# Altium schematic sheet Power.SchDoc
size Letter; SheetNumber: 8; PageSetup: Record=PageOptions|CenterHorizontal=True|CenterVertical=True|PrintScale=0.98|XCorrection=1.00|YCorrection=1.00|PrintKind=0|BorderSize=5000000|LeftOffset=0|BottomOffset=0|Orientation=2|PaperLength=1000|PaperWidth=1000|Scale=100|PaperSource=7|PrintQuality=-3|MediaType=1|DitherType=10|PrintScaleMode=1|PaperKind=Letter|PaperIndex=1
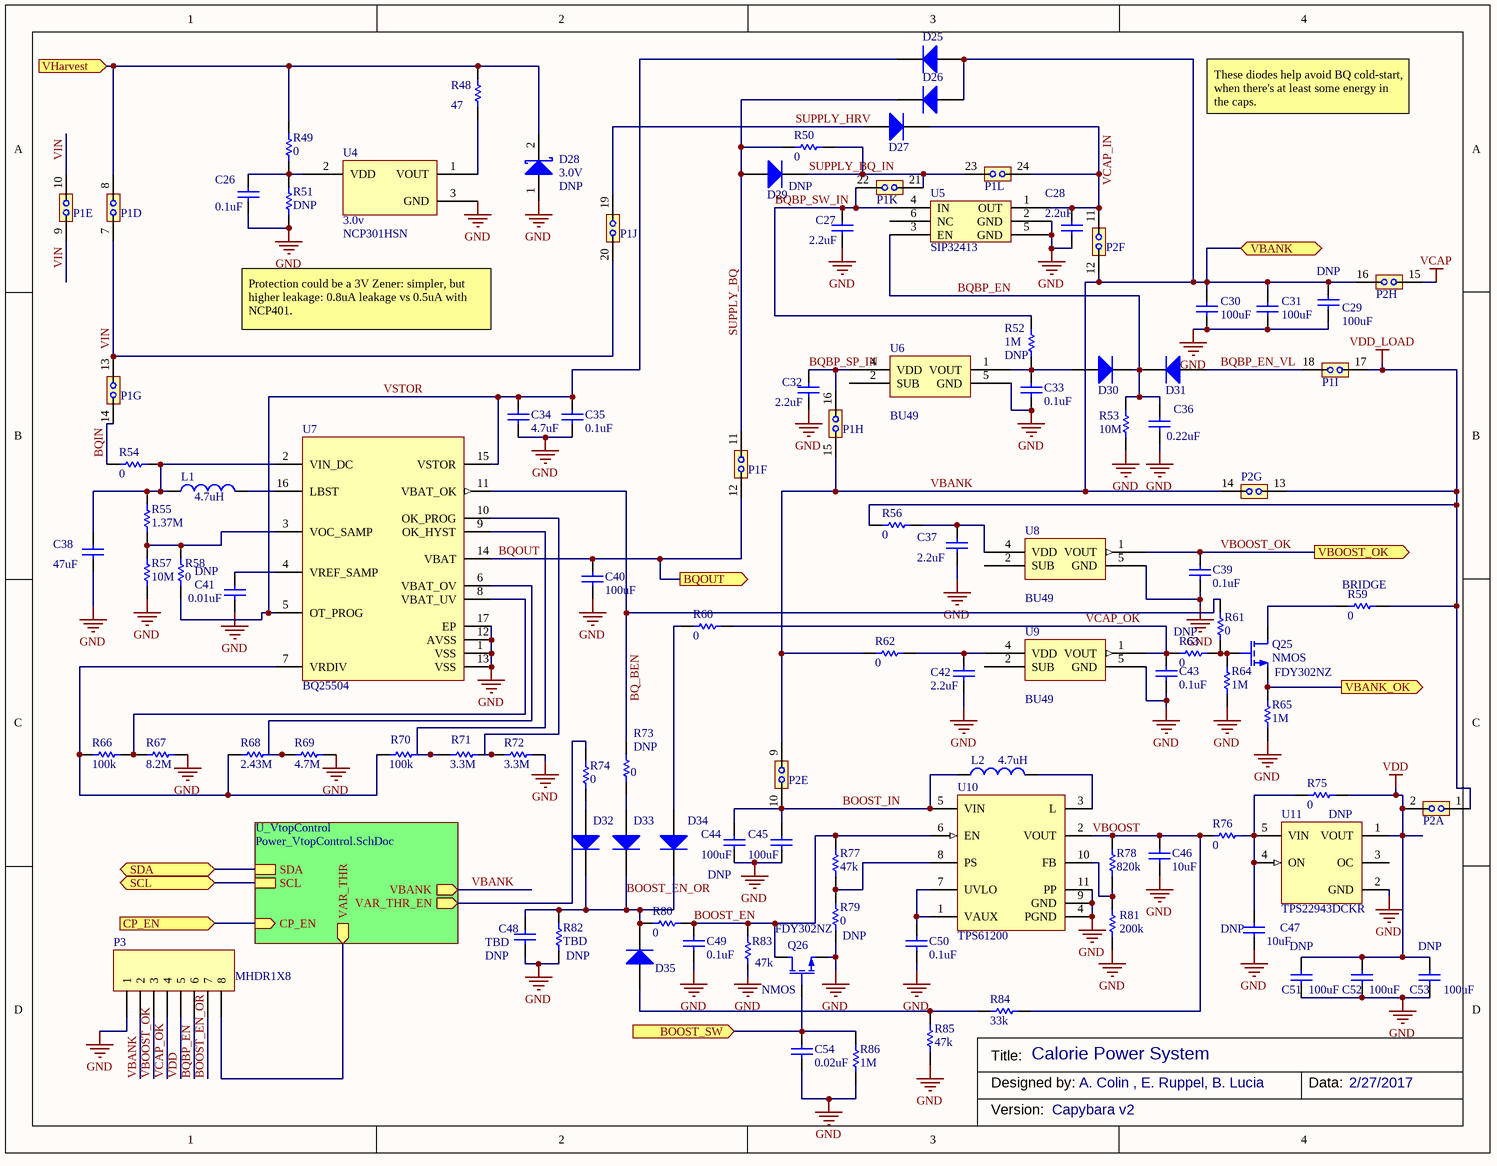
[diagram p0: Power.SchDoc]

## Parts
C26  value 0.1uF  [0603]  (hidden comment: Cap)
C27  value 2.2uF  [0603]  (hidden comment: Cap)
C28  value 2.2uF  [0603]  (hidden comment: Cap)
C29  value 100uF  Note: DNP  [0805]  (hidden comment: Cap)
C30  value 100uF  [0805]  (hidden comment: Cap)
C31  value 100uF  [0805]  (hidden comment: Cap)
C32  value 2.2uF  [0603]  (hidden comment: Cap)
C33  value 0.1uF  [0603]  (hidden comment: Cap)
C34  value 4.7uF  [0603]  (hidden comment: Cap)
C35  value 0.1uF  [0603]  (hidden comment: Cap)
C36  value 0.22uF  [0603]  (hidden comment: Cap)
C37  value 2.2uF  [0603]  (hidden comment: Cap)
C38  value 47uF  [0603]  (hidden comment: Cap)
C39  value 0.1uF  [0603]  (hidden comment: Cap)
C40  value 100uF  [0805]  (hidden comment: Cap)
C41  value 0.01uF  [0603]  (hidden comment: Cap)
C42  value 2.2uF  [0603]  (hidden comment: Cap)
C43  value 0.1uF  [0603]  (hidden comment: Cap)
C44  value 100uF  Note: DNP  [0805]  (hidden comment: Cap)
C45  value 100uF  [0805]  (hidden comment: Cap)
C46  value 10uF  [0603]  (hidden comment: Cap)
C47  value 10uF  Note: DNP  [0805]  (hidden comment: Cap)
C48  value TBD  Note: DNP  [0603]  (hidden comment: Cap)
C49  value 0.1uF  [0603]  (hidden comment: Cap)
C50  value 0.1uF  [0603]  (hidden comment: Cap)
C51  value 100uF  Note: DNP  [0805]  (hidden comment: Cap)
C52  value 100uF  [0805]  (hidden comment: Cap)
C53  value 100uF  Note: DNP  [0805]  (hidden comment: Cap)
C54  value 0.02uF  [0603]  (hidden comment: Cap)
D25  Diode  [SOD-523]  (value not drawn)
D26  Diode  [SOD-523]  (value not drawn)
D27  Diode  [SOD-523]  (value not drawn)
D28  3.0V  Note: DNP  [DIOD-SOD-123-2_V]
D29  Note: DNP  [SOD-523]  (hidden comment: Diode)
D30  Diode  [SOD-523]  (value not drawn)
D31  Diode  [SOD-523]  (value not drawn)
D32  Diode  [SOD-523]  (value not drawn)
D33  Diode  [SOD-523]  (value not drawn)
D34  Diode  [SOD-523]  (value not drawn)
D35  Diode  [SOD-523]  (value not drawn)
L1  value 4.7uH  [PFL1609]
L2  value 4.7uH  [PFL1609]
P1  JMPHDR_12  [MHDR2X12]  (value not drawn)  (parts D,E,F,G,H,I,J,K,L of 12)
P2  JMPHDR_8  (value not drawn)  (parts A,E,F,G,H of 8)
P3  MHDR1X8  [MHDR1X8]
Q25  NMOS  Manufacturer Part Number: FDY302NZ  [SOT-523-3]
Q26  NMOS  Manufacturer Part Number: FDY302NZ  [SOT-523-3]
R48  value 47  [0603]  (hidden comment: Res)
R49  value 0  [0603]  (hidden comment: Res)
R50  value 0  [0603]  (hidden comment: Res)
R51  value DNP  [0603]  (hidden comment: Res)
R52  value 1M  Note: DNP  [0603]  (hidden comment: Res)
R53  value 10M  [0603]  (hidden comment: Res)
R54  value 0  [0603]  (hidden comment: Res)
R55  value 1.37M  [0603]  (hidden comment: Res)
R56  value 0  [0603]  (hidden comment: Res)
R57  value 10M  [0603]  (hidden comment: Res)
R58  value 0  Note: DNP  [0603]  (hidden comment: Resistor)
R59  value 0  Note: BRIDGE  [0603]  (hidden comment: Res)
R60  value 0  [0603]  (hidden comment: Res)
R61  value 0  [0603]  (hidden comment: Res)
R62  value 0  [0603]  (hidden comment: Res)
R63  value 0  Note: DNP  [0603]  (hidden comment: Res)
R64  value 1M  [0603]  (hidden comment: Res)
R65  value 1M  [0603]  (hidden comment: Res)
R66  value 100k  [0603]  (hidden comment: Res)
R67  value 8.2M  [0603]  (hidden comment: Res)
R68  value 2.43M  [0603]  (hidden comment: Res)
R69  value 4.7M  [0603]  (hidden comment: Res)
R70  value 100k  [0603]  (hidden comment: Res)
R71  value 3.3M  [0603]  (hidden comment: Res)
R72  value 3.3M  [0603]  (hidden comment: Res)
R73  value 0  [0603]  (hidden comment: DNP)
R74  value 0  [0603]  (hidden comment: Res)
R75  value 0  [0603]  (hidden comment: Res)
R76  value 0  [0603]  (hidden comment: Res)
R77  value 47k  [0603]  (hidden comment: Res)
R78  value 820k  [0603]  (hidden comment: Res)
R79  value 0  [0603]  (hidden comment: DNP)
R80  value 0  [0603]  (hidden comment: Res)
R81  value 200k  [0603]  (hidden comment: Res)
R82  value TBD  Note: DNP  [0603]  (hidden comment: Res)
R83  value 47k  [0603]  (hidden comment: Res)
R84  value 33k  [0603]  (hidden comment: Res)
R85  value 47k  [0603]  (hidden comment: Res)
R86  value 1M  [0603]  (hidden comment: Res)
U4  value 3.0v  Name: NCP301HSN  [SOT23-5]  (hidden comment: NCP301)
U5  SIP32413  [SC70-6]
U6  Name: BU49  [SOP4]  (hidden comment: BU48)
U7  BQ25504  [VQFN-16]
U8  BU49  [SOP4]
U9  BU49  [SOP4]
U10  TPS61200  [VSON-10]
U11  TPS22943DCKR  Note: DNP  [SC70-5]

## Sub-sheets
U_VtopControl = Power_VtopControl.SchDoc: SDA, SCL, CP_EN (in), VAR_THR_EN (out), VAR_THR (out), VBANK

## Ports
BOOST_SW (in), BQOUT (out), CP_EN (in), SCL, SDA, VBANK, VBANK_OK (out), VBOOST_OK (out), VHarvest (in)

## Nets
GND: C26.1 C27.1 C28.1 C29.1 C30.1 C31.1 C32.1 C33.1 C34.1 C35.1 C36.1 C37.1 C38.2 C39.1 C40.1 C41.1 C42.1 C43.1 C44.1 C45.1 C46.1 C47.1 C48.2 C49.1 C50.1 C51.1 C52.1 C53.1 C54.1 D28.1(A) P3.1 Q26.2(S) R51.1 R53.1 R57.1 R64.1 R65.1 R67.2 R69.2 R72.2 R79.1 R81.1 R82.1 R83.1 R85.1 R86.1 U4.3(GND) U5.2(GND) U5.5(GND) U6.5(GND) U7.1(VSS) U7.12(AVSS) U7.13(VSS) U7.17(EP) U8.5(GND) U9.5(GND) U10.4(PGND) U10.9(GND) U10.11(PP) U11.2(GND)
VCAP: P2.15
VDD: C51.2 C52.2 C53.2 P2.2 P3.5 R75.2 U11.1(VOUT)
VDD_LOAD: P1.17 P2.1 P2.13 R56.2 R59.2
BOOST_EN: C49.2 Q26.3(D) R77.2 R80.2 R83.2 U10.6(EN)
BOOST_EN_OR: C48.1 D32.2(C) D33.2(C) D34.2(C) D35.2(C) P3.7 R80.1 R82.2
BOOST_IN: C44.2 C45.2 L2.1 P2.10 U10.5(VIN)
BOOST_SW: C54.2 Q26.1(G) R86.2 ; port BOOST_SW
BQ_BEN: R61.2 R73.2 U7.11(VBAT_OK)
BQBP_EN: C36.2 D30.2(C) D31.2(C) P3.6 R53.2 U5.3(EN)
BQBP_EN_VL: D31.1(A) P1.18
BQBP_SP_IN: C32.2 P1.16 U6.4(VDD)
BQBP_SW_IN: C27.2 P1.22 R52.2 U5.4(IN)
BQIN: P1.14 R54.1
BQOUT: C40.2 P1.12 U7.14(VBAT) ; port BQOUT
CP_EN: port CP_EN, sheet U_VtopControl/CP_EN
SCL: port SCL, sheet U_VtopControl/SCL
SDA: port SDA, sheet U_VtopControl/SDA
SUPPLY_BQ: D26.2(C) D29.1(A) P1.11 R50.1
SUPPLY_BQ_IN: D29.2(C) P1.21 P1.23 R50.2
SUPPLY_HRV: D27.1(A) P1.19
VBANK: C29.2 C30.2 C31.2 D25.1(A) D26.1(A) P1.15 P2.9 P2.12 P2.14 P2.16 P3.2 R62.1 ; port VBANK, sheet U_VtopControl/VBANK
VBANK_OK: Q25.2(S) R65.2 ; port VBANK_OK
VBOOST: C46.2 R76.1 R78.2 R84.2 U10.2(VOUT)
VBOOST_OK: C39.2 P3.3 U8.1(VOUT) ; port VBOOST_OK
VCAP_IN: C28.2 D27.2(C) P1.24 P2.11 U5.1(OUT)
VCAP_OK: C43.2 P3.4 R60.2 R63.1 U9.1(VOUT)
VHarvest: D28.2(K) P1.8 R48.1 R49.2 ; port VHarvest
VIN: P1.7 P1.9 P1.10 P1.13 P1.20
VSTOR: C34.2 C35.2 D25.2(C) R58.1 U7.5(OT_PROG) U7.15(VSTOR)
NetC26_2: C26.2 R49.1 R51.2 U4.2(VDD)
NetC33_2: C33.2 D30.1(A) R52.1 U6.1(VOUT)
NetC37_2: C37.2 R56.1 U8.4(VDD)
NetC38_1: C38.1 L1.1 R54.2 R55.2 U7.2(VIN_DC)
NetC41_2: C41.2 U7.4(VREF_SAMP)
NetC42_2: C42.2 R62.2 U9.4(VDD)
NetC47_2: C47.2 R75.1 R76.2 U11.4(ON) U11.5(VIN)
NetC50_2: C50.2 U10.1(VAUX) U10.7(UVLO)
NetD32_1: D32.1(A) R74.1
NetD33_1: D33.1(A) R73.1
NetD34_1: D34.1(A) R60.1
NetD35_1: D35.1(A) R84.1 R85.2
NetL1_2: L1.2 U7.16(LBST)
NetL2_2: L2.2 U10.3(L)
NetP3_8: P3.8 ; sheet U_VtopControl/VAR_THR
NetQ25_1: Q25.1(G) R61.1 R63.2 R64.2
NetQ25_3: Q25.3(D) R59.1
NetR48_2: R48.2 U4.1(VOUT)
NetR55_1: R55.1 R57.2 R58.2 U7.3(VOC_SAMP)
NetR66_1: R66.1 R68.1 R70.1 U7.7(VRDIV)
NetR66_2: R66.2 R67.1 U7.8(VBAT_UV)
NetR68_2: R68.2 R69.1 U7.6(VBAT_OV)
NetR70_2: R70.2 R71.1 U7.9(OK_HYST)
NetR71_2: R71.2 R72.1 U7.10(OK_PROG)
NetR74_2: R74.2 ; sheet U_VtopControl/VAR_THR_EN
NetR77_1: R77.1 R79.2 U10.8(PS)
NetR78_1: R78.1 R81.2 U10.10(FB)

Not connected (* = marked no-connect by the designer): U5 6(NC); U6 2(SUB); U8 2(SUB); U9 2(SUB); U11 3(OC)

## Notes on the sheet
- These diodes help avoid BQ cold-start, when there's at least some energy in the caps.
- Protection could be a 3V Zener: simpler, but higher leakage: 0.8uA leakage vs 0.5uA with NCP401.
- Title:
- Designed by:
- (near R84) Calorie Power System
- A. Colin , E. Ruppel, B. Lucia
- Data:
- 2/27/2017
- Version:
- Capybara v2

## Library data of the parts
C26 C33 C35 C39 C43 C49 C50 = Cap: Ceramic Capacitor (Surface Mount); Manufacturer: Murata Electronics North America; Manufacturer Part Number: GRM188R71C104KA01D; Note: *; Rating: *; Distributor Part Number: 490-1532-1-ND; Distributor: Digi-Key
  C26 C33 C35 C39 C43: Digi-Key Part Number: *
C27 C28 C32 C37 C42 = Cap: Ceramic Capacitor (Surface Mount); Manufacturer: Murata Electronics North America; Manufacturer Part Number: GRM188R61C225KE15D; Note: *; Rating: *; Distributor Part Number: 490-3296-1-ND; Distributor: Digi-Key
C29 = Cap: Ceramic Capacitor (Surface Mount); Manufacturer: Murata Electronics North America; Manufacturer Part Number: GRM21BR60J107ME15L; Rating: 6.3V; PurchaseNote: 47uF 587-3266-1-ND; Distributor Part Number: 490-13981-1-ND; Distributor: Digi-Key
C30 C31 = Cap: Ceramic Capacitor (Surface Mount); Manufacturer: Murata Electronics North America; Manufacturer Part Number: GRM21BR60G107ME15L; Rating: 6.3V; PurchaseNote: 47uF 587-3266-1-ND; Distributor: Mouser; Mouser Part Number: 81-GRM21BR60G107ME5L
C34 = Cap: Ceramic Capacitor (Surface Mount); Manufacturer: Samsung Electro-Mechanics; Manufacturer Part Number: CL10B475KQ8NQNC; Digi-Key Part Number: *; Note: *; Rating: *; Distributor Part Number: 1276-2087-1-ND; Distributor: Digi-Key
C36 = Cap: Ceramic Capacitor (Surface Mount); Manufacturer: Murata Electronics North America; Manufacturer Part Number: GRM188R71E224KA88D; Note: *; Rating: *; Distributor Part Number: 490-3290-1-ND; Distributor: Digi-Key
C38 = Cap: Ceramic Capacitor (Surface Mount); Manufacturer: Samsung Electro-Mechanics; Manufacturer Part Number: CL10A476MR8NZNE; Note: *; Distributor Part Number: 1276-6528-1-ND; Distributor: Digi-Key
C40 = Cap: Ceramic Capacitor (Surface Mount); Manufacturer: Murata Electronics North America; Manufacturer Part Number: GRM21BR60G107ME15L; Rating: 6.3V; Digi-Key Part Number: *; Note: *; Distributor: Mouser; Mouser Part Number: 81-GRM21BR60G107ME5L
C41 = Cap: Ceramic Capacitor (Surface Mount); Manufacturer: Murata Electronics North America; Manufacturer Part Number: GRM155R71E103JA01J; Rating: X7R, 10%; Note: *; Distributor Part Number: 490-6340-1-ND; Distributor: Digi-Key
C44 C45 = Cap: Ceramic Capacitor (Surface Mount); Manufacturer: Murata Electronics North America; Manufacturer Part Number: GRM21BR60G107ME15L; PurchaseNote: or CL10A476MR8NZNE 4.0V 0.8mm; Rating: *; Distributor: Mouser; Mouser Part Number: 81-GRM21BR60G107ME5L
  C45: Note: *
C46 = Cap: Ceramic Capacitor (Surface Mount); Manufacturer: Murata Electronics North America; Manufacturer Part Number: GRM188R60J106ME47D; Note: *; Rating: *; Distributor Part Number: 490-3896-1-ND; Distributor: Digi-Key
C47 = Cap: Ceramic Capacitor (Surface Mount); Manufacturer: Murata Electronics North America; Manufacturer Part Number: GRM21BR61E106MA73L; Rating: *; Distributor Part Number: 490-10748-1-ND; Distributor: Digi-Key
C48 = Cap: Ceramic Capacitor (Surface Mount); Manufacturer: Generic Ceramic Chip Cap (TBD); Digi-Key Part Number: *; Manufacturer Part Number: *; Rating: *; Distributor Part Number: *; Distributor: *
C51-C53 = Cap: Ceramic Capacitor (Surface Mount); Manufacturer: Murata Electronics North America; Manufacturer Part Number: GRM21BR60G107ME15L; Rating: *; Distributor: Mouser; Mouser Part Number: 81-GRM21BR60G107ME5L
  C52: Note: *
C54 = Cap: Ceramic Capacitor (Surface Mount); Manufacturer: Samsung Electro-Mechanics; Manufacturer Part Number: CL10B203KB8NNNC; Digi-Key Part Number: *; Note: *; Rating: *; Distributor Part Number: 1276-1984-1-ND; Distributor: Digi-Key
D25-D27 D29-D35 = Diode: General Purpose Diode; Manufacturer: Vishay Semiconductor; Manufacturer Part Number: BAS40-02V-V-G-08; Digi-Key Part Number: BAS40-02V-V-G-08GICT-ND; Value: *; Rating: *; Distributor Part Number: 78-BAS40-02V-V-G-08; Distributor: Mouser; Mouser Part Number: 78-BAS40-02V-V-G-08
  D27 D30-D35: Note: *
D28 = CMP-0303-00003-1: 1.0 A Surface Mount Schottky Barrier Rectifier, 40 V, -65 to 125 degC, 2-Pin SOD-123 Package, RoHS, Tape and Reel; Manufacturer Part Number: MMSZ4683-TP; Manufacturer: Micro Commercial Co; PackageDescription: 2-Pin SOD-123, Body 2.7 x 1.55 mm, Pitch 3.7 mm; PackageReference: SOD-123-2; Digi-Key Part Number: MMSZ4683-TPMSCT-ND
L1 L2 = Inductor: Manufacturer: Coilcraft; Manufacturer Part Number: PFL1609-472MEU; PackageReference: PFL1609; Distributor: Mouser; Distributor Part Number: 994-PFL1609-472MEU
P2 = JMPHDR_8: Manufacturer: Sullins Connector Solutions; Manufacturer Part Number: GRPB082VWVN-RC; Digi-Key Part Number: S9015E-08-ND; Distributor: Digikey; Distributor Part Number: S9015E-08-ND
P3 = MHDR1X8: Header, 8-Pin; Manufacturer: Harwin Inc.; Manufacturer Part Number: M52-5000845; LatestRevisionDate: 17-Jul-2002; LatestRevisionNote: Re-released for DXP Platform.; Publisher: Altium Limited; Digi-Key Part Number: 952-3361-ND; Distributor: Mouser; Distributor Part Number: 855-M52-5000845; Mouser Part Number: 855-M52-5000845
Q25 Q26 = MOSFET-N: N-Channel MOSFET; Manufacturer: Fairchild; Note: *; Rating: *; Value: NMOS; Distributor: Digi-Key; Distributor Part Number: FDY302NZCT-ND
  Q26: Digi-Key Part Number: *
R48 = Res: Chip Resistor (Surface Mount); Manufacturer: Yageo; Manufacturer Part Number: RC0603JR-0747RL; Digi-Key Part Number: *; Rating: *; Note: *; Distributor: Digi-Key; Distributor Part Number: 311-47GRCT-ND
R49 R50 R54 R56 R58-R63 R73-R76 R79 R80 = Res: Chip Resistor (Surface Mount); Manufacturer: Yageo; Manufacturer Part Number: RC0603JR-070RL; Rating: *; Distributor: Digi-Key; Distributor Part Number: 311-0.0GRCT-ND
  R49 R54 R56 R60-R62 R80: Note: *
  R73: Digi-Key Part Number: *; Note: DNP
  R74 R76: Digi-Key Part Number: *; Note: *
  R75: Digi-Key Part Number: *
  R79: Note: DNP
R51 = Res: Chip Resistor (Surface Mount); Manufacturer: Yageo; Digi-Key Part Number: *; Rating: *; Note: *; Distributor: Digi-Key
R52 R64 R65 = Res: Chip Resistor (Surface Mount); Manufacturer: Yageo; Manufacturer Part Number: RC0603FR-071ML; Rating: *; Distributor: Digi-Key; Distributor Part Number: 311-1.00MHRCT-ND
  R52: Digi-Key Part Number: *
  R64 R65: Note: *
R53 R57 R86 = Res: Chip Resistor (Surface Mount); Manufacturer: Yageo; Manufacturer Part Number: RC0603JR-0710ML; Rating: *; Distributor: Digi-Key; Distributor Part Number: 311-10MGRCT-ND
  R57: Note: *
  R86: Digi-Key Part Number: *; Note: *
R55 = Res: Chip Resistor (Surface Mount); Manufacturer: Vishay Dale; Manufacturer Part Number: CRCW04021M37FKED; Rating: *; Note: *; Distributor: Digi-Key; Distributor Part Number: 541-1.37MLCT-ND
R66 = Res: Chip Resistor (Surface Mount); Manufacturer: Yageo; Manufacturer Part Number: RT0603FRE07100KL; Rating: 1%; Note: *; Distributor: Digi-Key; Distributor Part Number: YAG2319CT-ND
R67 = Res: Chip Resistor (Surface Mount); Manufacturer: Vishay Dale; Manufacturer Part Number: CRCW06038M20FKEA; Rating: 1%; Note: *; Distributor: Digi-Key; Distributor Part Number: 541-8.20MHCT-ND
R68 = Res: Chip Resistor (Surface Mount); Manufacturer: Vishay; Manufacturer Part Number: CRCW06032M43FKEA; Note: *; Distributor: Mouser; Distributor Part Number: 71-CRCW0603-2.43M-E3; Mouser Part Number: 71-CRCW0603-2.43M-E3
R69 = Res: Chip Resistor (Surface Mount); Manufacturer: Generic Chip Res (TBD); Manufacturer Part Number: RC0603FR-074M7L; Rating: 1%; Note: *; Distributor: Digi-Key; Distributor Part Number: 311-4.70MHRCT-ND
R70 R71 = Res: Chip Resistor (Surface Mount); Manufacturer: Yageo; Manufacturer Part Number: RC0603FR-071M6L; Rating: 1%; Distributor: Digi-Key; Distributor Part Number: YAG3327CT-ND
R72 = Res: Chip Resistor (Surface Mount); Manufacturer: Vishay Dale; Manufacturer Part Number: CRCW06033M30FKEA; Rating: 1%; Distributor: Digi-Key; Distributor Part Number: 541-3.30MHCT-ND
R77 R83 R85 = Res: Chip Resistor (Surface Mount); Manufacturer: Yageo; Manufacturer Part Number: RT0603DRD0747KL; Rating: *; Note: *; Distributor: Digi-Key; Distributor Part Number: 311-47KDCT-ND
  R85: Digi-Key Part Number: *
R78 = Res: Chip Resistor (Surface Mount); Manufacturer: Yageo; Manufacturer Part Number: RC0603FR-07820KL; Rating: *; Distributor: Digi-Key; Distributor Part Number: 311-820KHRCT-ND
R81 = Res: Chip Resistor (Surface Mount); Manufacturer: Yageo; Manufacturer Part Number: RC0603FR-07200KL; Rating: *; Note: *; Distributor: Digi-Key; Distributor Part Number: 311-200KHRCT-ND
R82 = Res: Chip Resistor (Surface Mount); Manufacturer: Generic Chip Res (TBD); Manufacturer Part Number: *; Digi-Key Part Number: *; Rating: *
R84 = Res: Chip Resistor (Surface Mount); Manufacturer: Yageo; Manufacturer Part Number: RT0603DRE0733KL; Digi-Key Part Number: *; Rating: *; Note: *; Distributor: Digi-Key; Distributor Part Number: 311-2543-1-ND
U4 = NCP301: IC DETECTOR OPEN-DRAIN; Manufacturer: ON Semiconductor; Manufacturer Part Number: NCP301HSN30T1G; Digi-Key Part Number: NCP301HSN30T1GOSCT-ND; Distributor: Mouser; Distributor Part Number: 863-NCP301HSN30T1G; Mouser Part Number: 863-NCP301HSN30T1G
U5 = SIP32431: Manufacturer: Vishay Semiconductors; Manufacturer Part Number: SIP32431DR3-T1GE3; Digi-Key Part Number: SIP32431DR3-T1GE3CT-ND; Distributor: Mouser; Distributor Part Number: 781-SIP32431DR3-GE3; Mouser Part Number: 781-SIP32431DR3-GE3
U6 = BU48: IC DETECTOR OPEN-DRAIN; pin to pad: 2>3 4>2 5>4; Manufacturer: ROHM Semiconductor; Manufacturer Part Number: BU4917F-TR; Digi-Key Part Number: BU4917F-TR-ND; Distributor: Quest Components; Distributor Part Number: BU4917F-TR; Mouser Part Number: 755-BU4917F-TR
U7 = BQ25504: Manufacturer: BQ25504RGTT; Manufacturer Part Number: Texas Instruments; Digi-Key Part Number: 296-29741-1-ND; Distributor: Mouser; Distributor Part Number: 595-BQ25504RGTR; Mouser Part Number: 595-BQ25504RGTR
U8 U9 = BU49: IC DETECTOR CMOS; pin to pad: 2>3 4>2 5>4; Manufacturer: ROHM Semiconductor; Manufacturer Part Number: BU4924F-TR; Name: BU49; Digi-Key Part Number: BU4924F-TR-ND; Distributor: Quest Components; Distributor Part Number: BU4924F-TR; Mouser Part Number: 755-BU4924F-TR
U10 = TPS61200: Manufacturer: Texas Instruments; Manufacturer Part Number: TPS61200DRCR; Distributor: Digi-Key; Distributor Part Number: 296-27017-1-ND; Digi-Key Part Number: 296-27017-1-ND; Mouser Part Number: 595-TPS61200DRCR
U11 = CMP-0329-00079-2: Low-Input Voltage 40 mA Current Limited Load Switch, 400 mOhms rDS(On), -40 to 85 degC, 5-pin SC70 (DCK), Green (RoHS & no Sb/Br); Manufacturer: Texas Instruments; SubFamily: Current Limited Switch; Vin(Min)(V): 1.62; Number of FETs: 1; Adjustable Current Limit(Min)(A): 0.04; Enable/Shutdown: Active High; Vin(Max)(V): 5.5; rDS(on) per FET(Typ)(mOhms): 400; Iq(Typ)(uA): 40; PackageReference: DCK0005A; PackageDescription: 5-Pin Plastic Small-Outline Package, 2 x 1.3 mm Body, 0.65 mm Pitch, 2.1 mm Lead Span; DatasheetVersion: SLVS832C; ComponentLink1URL: http://www.ti.com/general/docs/lit/getliterature.tsp?genericPartNumber=TPS22943&fileType=pdf; Mounting Technology: Surface Mount; Code_JEDEC: MO-203-AA; PartNumber: TPS22943DCKR; PackageVersion: revG, Jan-2007; Eco-Plan: Green (RoHS & no Sb/Br); ComponentLink1Description: Datasheet; Distributor: Digi-Key; Distributor Part Number: 296-25316-1-ND; Manufacturer Part Number: TPS22943DCKR; Digi-Key Part Number: 296-25316-1-ND; Mouser Part Number: 595-TPS22943DCKR